# EAGLE design EN715_ExpansionBoard_ver1_2 (EAGLE 9.6.2)
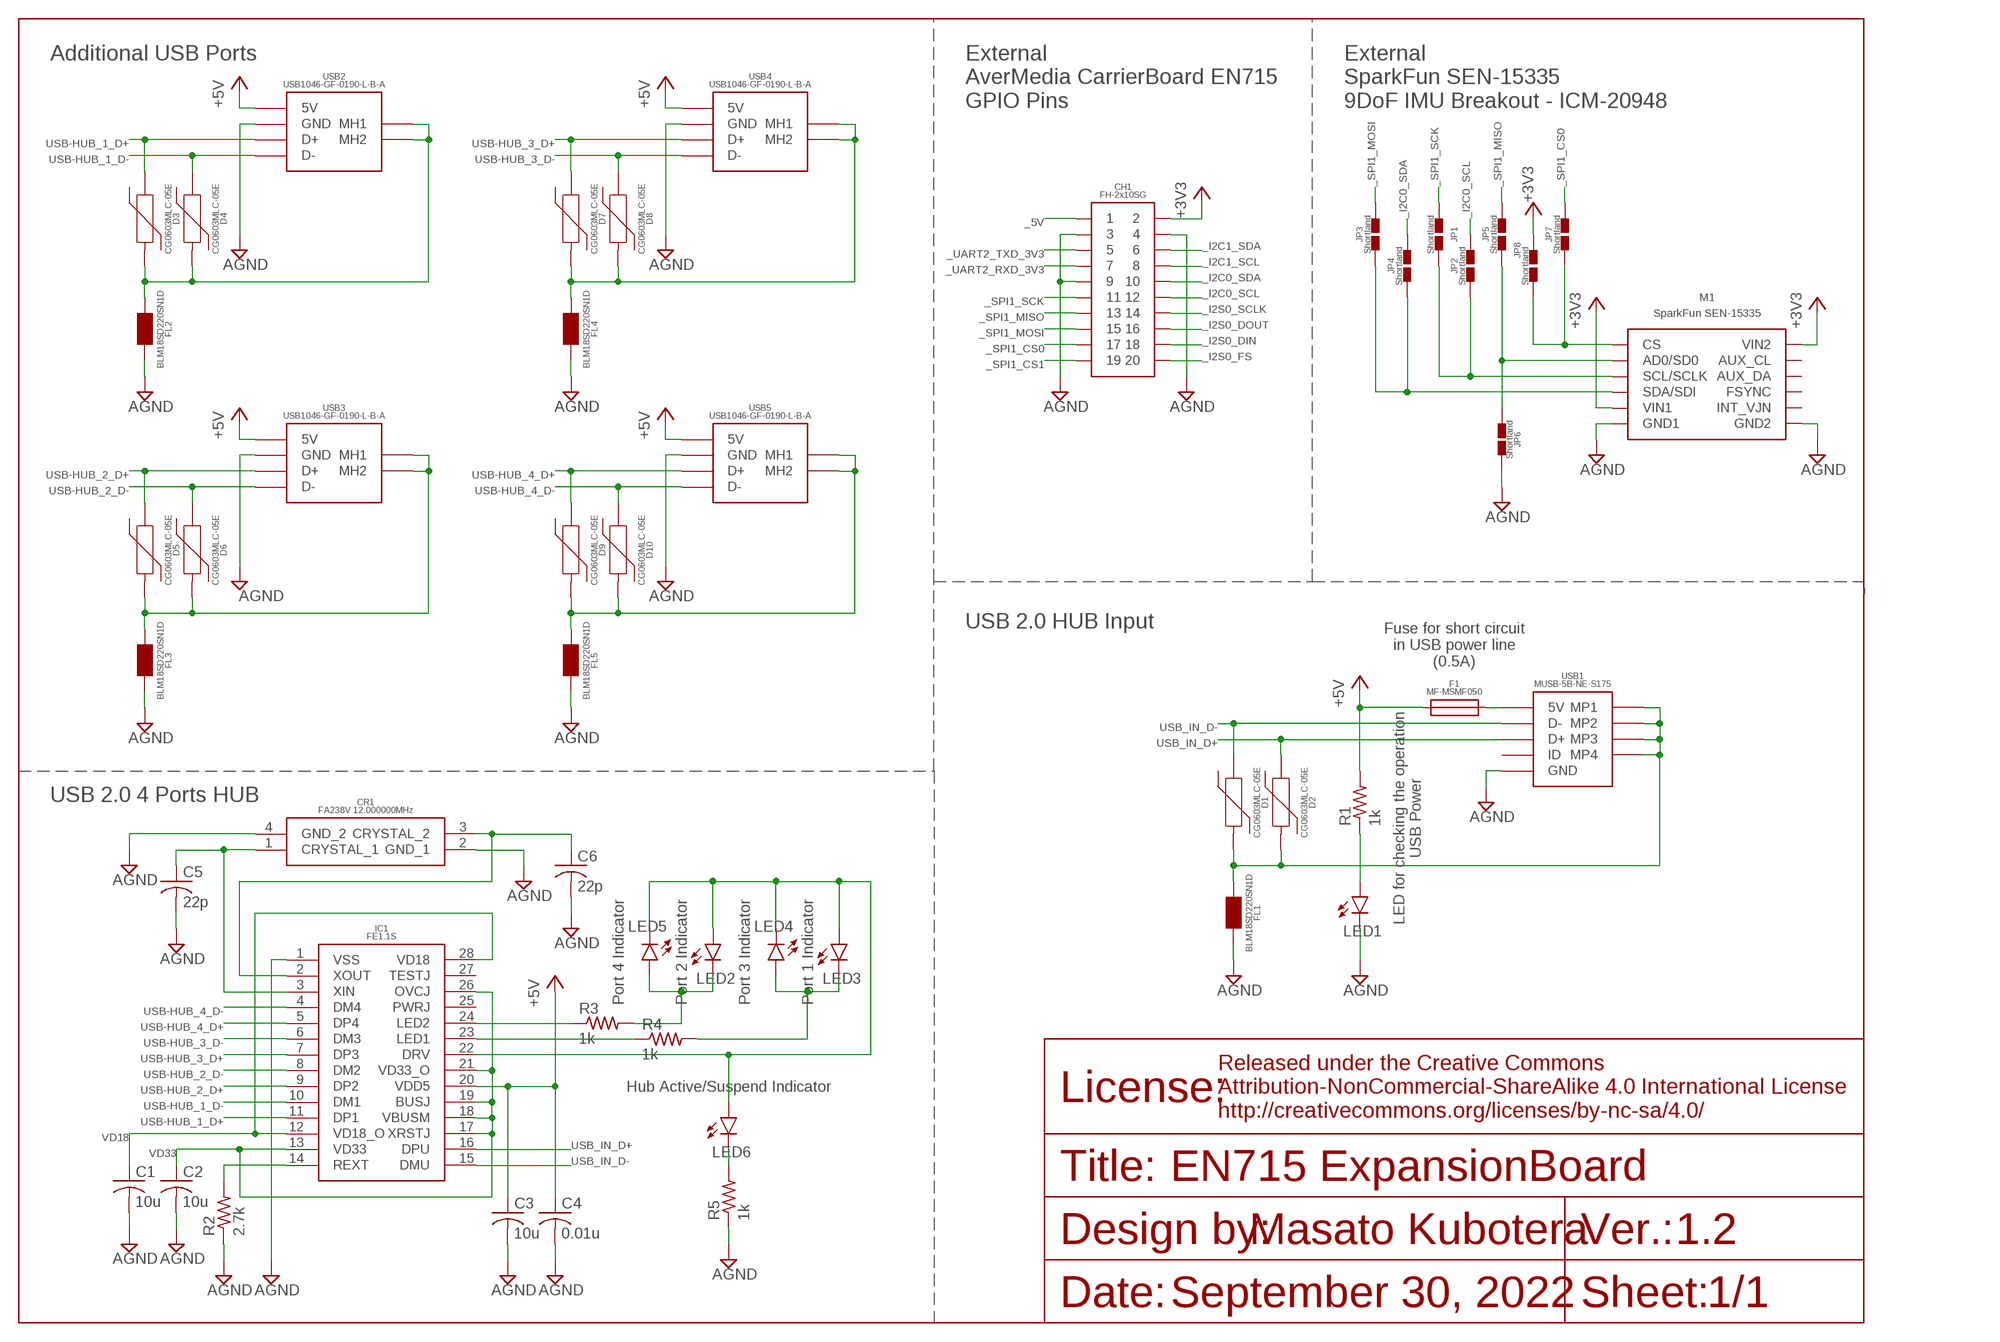
[diagram p0: schematic, sheet 1]

## Parts
C1  10u  C-USC0603  [C0603]
C2  10u  C-USC0603  [C0603]
C3  10u  C-USC0603  [C0603]
C4  0.01u  C-USC0603  [C0603]
C5  22p  C-USC0603  [C0603]
C6  22p  C-USC0603  [C0603]
CH1  2X10  [2X10]
CR1  FA238V_12.000000MHZ  [FA238V]
D1  CG0603MLC-05E  [CG0603MLC-05E]
D2  CG0603MLC-05E  [CG0603MLC-05E]
D3  CG0603MLC-05E  [CG0603MLC-05E]
D4  CG0603MLC-05E  [CG0603MLC-05E]
D5  CG0603MLC-05E  [CG0603MLC-05E]
D6  CG0603MLC-05E  [CG0603MLC-05E]
D7  CG0603MLC-05E  [CG0603MLC-05E]
D8  CG0603MLC-05E  [CG0603MLC-05E]
D9  CG0603MLC-05E  [CG0603MLC-05E]
D10  CG0603MLC-05E  [CG0603MLC-05E]
F1  MF-MSMF050  [MF-MSMF050]
FL1  BLM18SD220SN1D  [BLM18SD220SN1D]
FL2  BLM18SD220SN1D  [BLM18SD220SN1D]
FL3  BLM18SD220SN1D  [BLM18SD220SN1D]
FL4  BLM18SD220SN1D  [BLM18SD220SN1D]
FL5  BLM18SD220SN1D  [BLM18SD220SN1D]
IC1  FE1.1S  [FE1.1S]
JP1  SHORTLAND  [SHORTLAND]
JP2  SHORTLAND  [SHORTLAND]
JP3  SHORTLAND  [SHORTLAND]
JP4  SHORTLAND  [SHORTLAND]
JP5  SHORTLAND  [SHORTLAND]
JP6  SHORTLAND  [SHORTLAND]
JP7  SHORTLAND  [SHORTLAND]
JP8  SHORTLAND  [SHORTLAND]
LED1  LEDSML0603  [SML0603]
LED2  LEDSML0603  [SML0603]
LED3  LEDSML0603  [SML0603]
LED4  LEDSML0603  [SML0603]
LED5  LEDSML0603  [SML0603]
LED6  LEDSML0603  [SML0603]
M1  SPARKFUN_SEN-15335  [SPARKFUN_SEN-15335]
R1  1k  R-US_R0603  [R0603]
R2  2.7k  R-US_R0603  [R0603]
R3  1k  R-US_R0603  [R0603]
R4  1k  R-US_R0603  [R0603]
R5  1k  R-US_R0603  [R0603]
USB1  MINI_USB_B_SMD  [MINI_USB_B_SMD]
USB2  USB_A_X1_SMD  [USB_A_X1_SMD]
USB3  USB_A_X1_SMD  [USB_A_X1_SMD]
USB4  USB_A_X1_SMD  [USB_A_X1_SMD]
USB5  USB_A_X1_SMD  [USB_A_X1_SMD]

## Nets
+3V3 [USB-Power]: CH1.2 JP8.2 M1.VIN1(VIN2) M1.VIN(VIN1)
+5V [USB-Power]: C3.1 C4.1 F1.1 IC1.20(VDD5) R1.2 USB2.1(5V) USB3.1(5V) USB4.1(5V) USB5.1(5V)
_5V [USB-Power]: CH1.1
_I2C0_SCL [USB-Data]: CH1.12 JP2.2
_I2C0_SDA [USB-Data]: CH1.10 JP4.2
_I2C1_SCL [USB-Data]: CH1.8
_I2C1_SDA [USB-Data]: CH1.6
_I2S0_DIN [USB-Data]: CH1.18
_I2S0_DOUT [USB-Data]: CH1.16
_I2S0_FS [USB-Data]: CH1.20
_I2S0_SCLK [USB-Data]: CH1.14
_SPI1_CS0 [USB-Data]: CH1.17 JP7.2
_SPI1_CS1 [USB-Data]: CH1.19
_SPI1_MISO [USB-Data]: CH1.13 JP5.2
_SPI1_MOSI [USB-Data]: CH1.15 JP3.2
_SPI1_SCK [USB-Data]: CH1.11 JP1.2
_UART2_RXD_3V3 [USB-Data]: CH1.7
_UART2_TXD_3V3 [USB-Data]: CH1.5
AGND [USB-Power]: C1.2 C2.2 C3.2 C4.2 C5.2 C6.2 CH1.3 CH1.4 CH1.9 CR1.2(GND_1) CR1.4(GND_2) FL1.2 FL2.2 FL3.2 FL4.2 FL5.2 IC1.1(VSS) JP6.2 LED1.C M1.GND1 M1.GND2 R2.1 R5.1 USB1.5(GND) USB2.4(GND) USB3.4(GND) USB4.4(GND) USB5.4(GND)
B_FUSE_USB_MINI_B [USB-Power]: F1.2 USB1.1(5V)
FE1.1S_DRV [LED-Power]: IC1.22(DRV) LED2.A LED3.A LED4.C LED5.C LED6.A
FE1.1S_DRV_LED_A [LED-Power]: LED6.C R5.2
FE1.1S_LED_1_A [LED-Power]: LED3.C LED4.A R4.2
FE1.1S_LED_1_B [LED-Power]: IC1.23(LED1) R4.1
FE1.1S_LED_2_A [LED-Power]: LED2.C LED5.A R3.2
FE1.1S_LED_2_B [LED-Power]: IC1.24(LED2) R3.1
IMU_AD0/SD0 [USB-Data]: JP5.1 JP6.1 M1.AD0/SD0
IMU_SCL/SCLK [USB-Data]: JP1.1 JP2.1 M1.SCL/SCLK
IMU_SDA/SDI [USB-Data]: JP3.1 JP4.1 M1.SDA/SDI
LED_USBIN [LED-Power]: LED1.A R1.1
MPU9250_CS [USB-Data]: JP7.1 JP8.1 M1.CS
REXT_FE1.1S [USB-Data]: IC1.14(REXT) R2.2
USB-HUB_1_D+ [USB-Data]: D3.1 IC1.11(DP1) USB2.3(D+)
USB-HUB_1_D- [USB-Data]: D4.1 IC1.10(DM1) USB2.2(D-)
USB-HUB_2_D+ [USB-Data]: D5.1 IC1.9(DP2) USB3.3(D+)
USB-HUB_2_D- [USB-Data]: D6.1 IC1.8(DM2) USB3.2(D-)
USB-HUB_3_D+ [USB-Data]: D7.1 IC1.7(DP3) USB4.3(D+)
USB-HUB_3_D- [USB-Data]: D8.1 IC1.6(DM3) USB4.2(D-)
USB-HUB_4_D+ [USB-Data]: D9.1 IC1.5(DP4) USB5.3(D+)
USB-HUB_4_D- [USB-Data]: D10.1 IC1.4(DM4) USB5.2(D-)
USB_A_1_SHIELD [USB-Data]: D3.2 D4.2 FL2.1 USB2.MH1 USB2.MH2
USB_A_2_SHIELD [USB-Data]: D5.2 D6.2 FL3.1 USB3.MH1 USB3.MH2
USB_A_3_SHIELD [USB-Data]: D7.2 D8.2 FL4.1 USB4.MH1 USB4.MH2
USB_A_4_SHIELD [USB-Data]: D9.2 D10.2 FL5.1 USB5.MH1 USB5.MH2
USB_IN_D+ [USB-Data]: D2.1 IC1.16(DPU) USB1.3(D+)
USB_IN_D- [USB-Data]: D1.1 IC1.15(DMU) USB1.2(D-)
USB_MINI_B_SHIELD [USB-Data]: D1.2 D2.2 FL1.1 USB1.MP1 USB1.MP2 USB1.MP3 USB1.MP4
VD18 [USB-Power]: C1.1 IC1.12(VD18_O) IC1.28(VD18)
VD33 [USB-Power]: C2.1 IC1.13(VD33) IC1.17(XRSTJ) IC1.18(VBUSM) IC1.19(BUSJ) IC1.21(VD33_O) IC1.26(OVCJ)
XIN_FE1.1S [USB-Data]: C5.1 CR1.1(CRYSTAL_1) IC1.3(XIN)
XOUT_FE1.1S [USB-Data]: C6.1 CR1.3(CRYSTAL_2) IC1.2(XOUT)
Unconnected: IC1.25(PWRJ) IC1.27(TESTJ) M1.AUX_CL M1.AUX_DA M1.FSYNC M1.INT_VJN USB1.4(ID)

## Notes on the sheet
- Additional USB Ports
- External
  AverMedia CarrierBoard EN715
  GPIO Pins
- External
  SparkFun SEN-15335
  9DoF IMU Breakout - ICM-20948
- USB 2.0 HUB Input
- Fuse for short circuit
  in USB power line
  (0.5A)
- USB 2.0 4 Ports HUB
- LED for checking the operation
  USB Power
- Port 4 Indicator | Port 2 Indicator | Port 3 Indicator | Port 1 Indicator
- Hub Active/Suspend Indicator
- EN715 ExpansionBoard
- 1.2
- September 30, 2022 | 1/1

## Library data of the parts
C1-C6 = rcl:C-US: CAPACITOR, American symbol; SPICEPREFIX: C
CH1 = Pin_socket:2X10
CR1 = FA238V:FA238V_12.000000MHZ
D1-D10 = CG0603MLC-05E:CG0603MLC-05E
F1 = MF-MSMF:MF-MSMF050
FL1-FL5 = BLM18SD220SN1D:BLM18SD220SN1D
IC1 = FE1.1S:FE1.1S
JP1-JP8 = Shortland:SHORTLAND
LED1-LED6 = led:LED: LED OSRAM: - CHIPLED LG R971, LG N971, LY N971, LG Q971, LY Q971, LO R971, LY R971 LH N974, LH R974 LS Q976, LO Q976, LY Q976 LO Q996 - Hyper CHIPLED LW Q18S LB Q993, LB Q99A, LB R99A - SideLED LS A670, LO A670, LY A670, LG A670, LP A670 LB A673, LV A673, LT A673, LW A673 LH A674 LY A675 LS A676, LA A676, LO A676, LY A676, LW A676 LS A679, LY A679, LG A679 - Hyper Micro SIDELED® LS Y876, LA Y876, LO Y876, LY Y876 LT Y87S - SmartLED LW L88C, LW L88S LB L89C, LB L89S, LG L890 LS L89K, LO L89K, LY L89K LS L896, LA L896, LO L896, LY L896 - TOPLED LS T670, LO T670, LY T670, LG T670, LP T670 LSG T670, LSP T670, LSY T670, LOP T670, LYG T670 LG T671, LOG T671, LSG T671 LB T673, LV T673, LT T673, LW T673 LH T674 LS T676, LA T676, LO T676, LY T676, LB T676, LH T676, LSB T676, LW T676 LB T67C, LV T67C, LT T67C, LS T67K, LO T67K, LY T67K, LW E67C LS E67B, LA E67B, LO E67B, LY E67B, LB E67C, LV E67C, LT E67C LW T67C LS T679, LY T679, LG T679 LS T770, LO T770, LY T770, LG T770, LP T770 LB T773, LV T773, LT T773, LW T773 LH T774 LS E675, LA E675, LY E675, LS T675 LS T776, LA T776, LO T776, LY T776, LB T776 LHGB T686 LT T68C, LB T68C - Hyper Mini TOPLED® LB M676 - Mini TOPLED Santana® LG M470 LS M47K, LO M47K, LY M47K Source: http://www.osram.convergy.de LUXEON: - LUMILED® LXK2-PW12-R00, LXK2-PW12-S00, LXK2-PW14-U00, LXK2-PW14-V00 LXK2-PM12-R00, LXK2-PM12-S00, LXK2-PM14-U00 LXK2-PE12-Q00, LXK2-PE12-R00, LXK2-PE12-S00, LXK2-PE14-T00, LXK2-PE14-U00 LXK2-PB12-K00, LXK2-PB12-L00, LXK2-PB12-M00, LXK2-PB14-N00, LXK2-PB14-P00, LXK2-PB14-Q00 LXK2-PR12-L00, LXK2-PR12-M00, LXK2-PR14-Q00, LXK2-PR14-R00 LXK2-PD12-Q00, LXK2-PD12-R00, LXK2-PD12-S00 LXK2-PH12-R00, LXK2-PH12-S00 LXK2-PL12-P00, LXK2-PL12-Q00, LXK2-PL12-R00 Source: www.luxeon.com KINGBRIGHT: KA-3528ASYC Source: www.kingbright.com
M1 = SparkFun SEN-15335:SPARKFUN_SEN-15335
R1-R5 = rcl:R-US_: RESISTOR, American symbol; SPICEPREFIX: R
USB1 = USB_Connector:MINI_USB_B_SMD
USB2-USB5 = USB_Connector:USB_A_X1_SMD

## Net classes
1 USB-Data: width 0.254 mm, drill 0.127 mm, clearance 0.203 mm
2 USB-Power: width 0.381 mm, drill 0.127 mm, clearance 0.203 mm
3 LED-Power: width 0.254 mm, drill 0.127 mm, clearance 0.203 mm

## Board
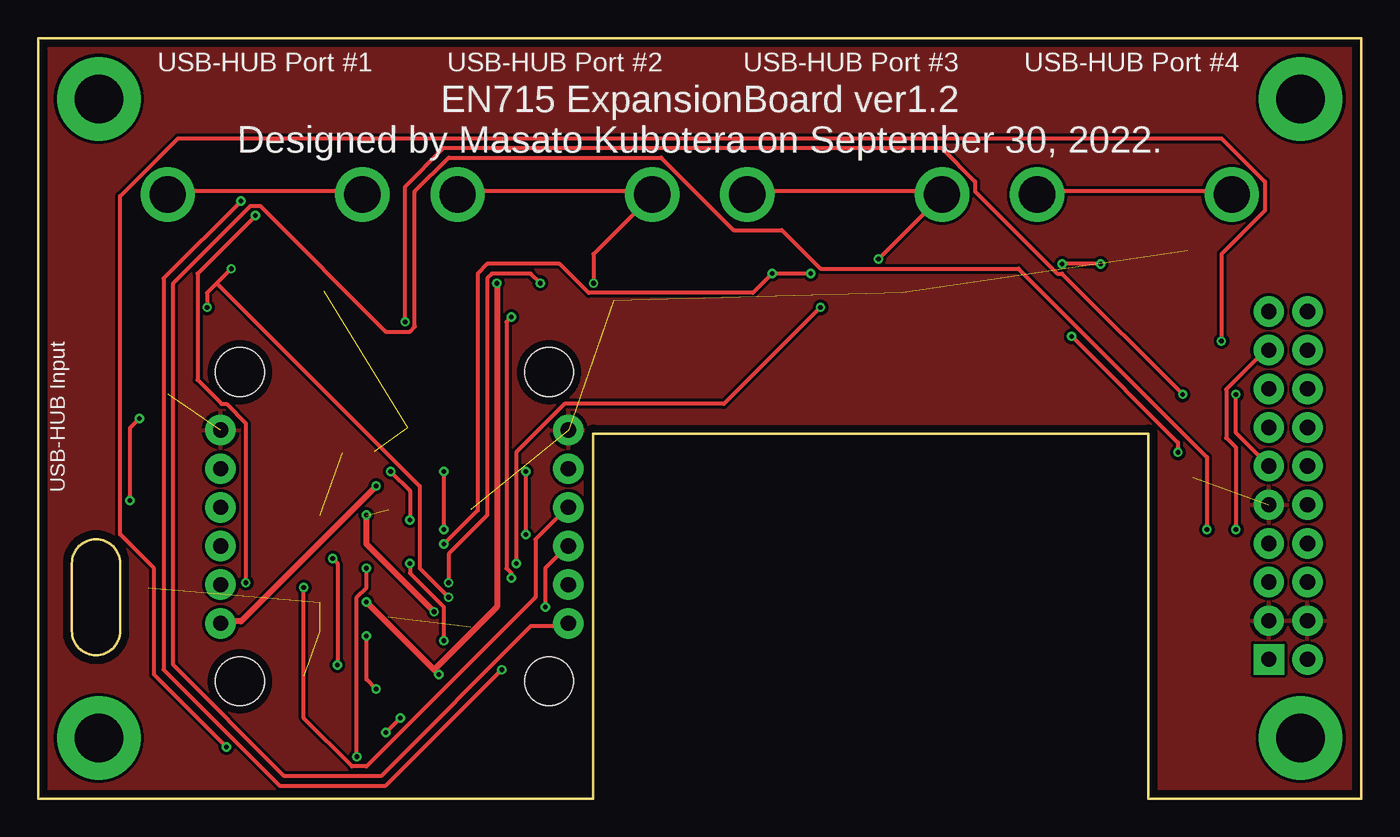
[diagram p1: board, top side]
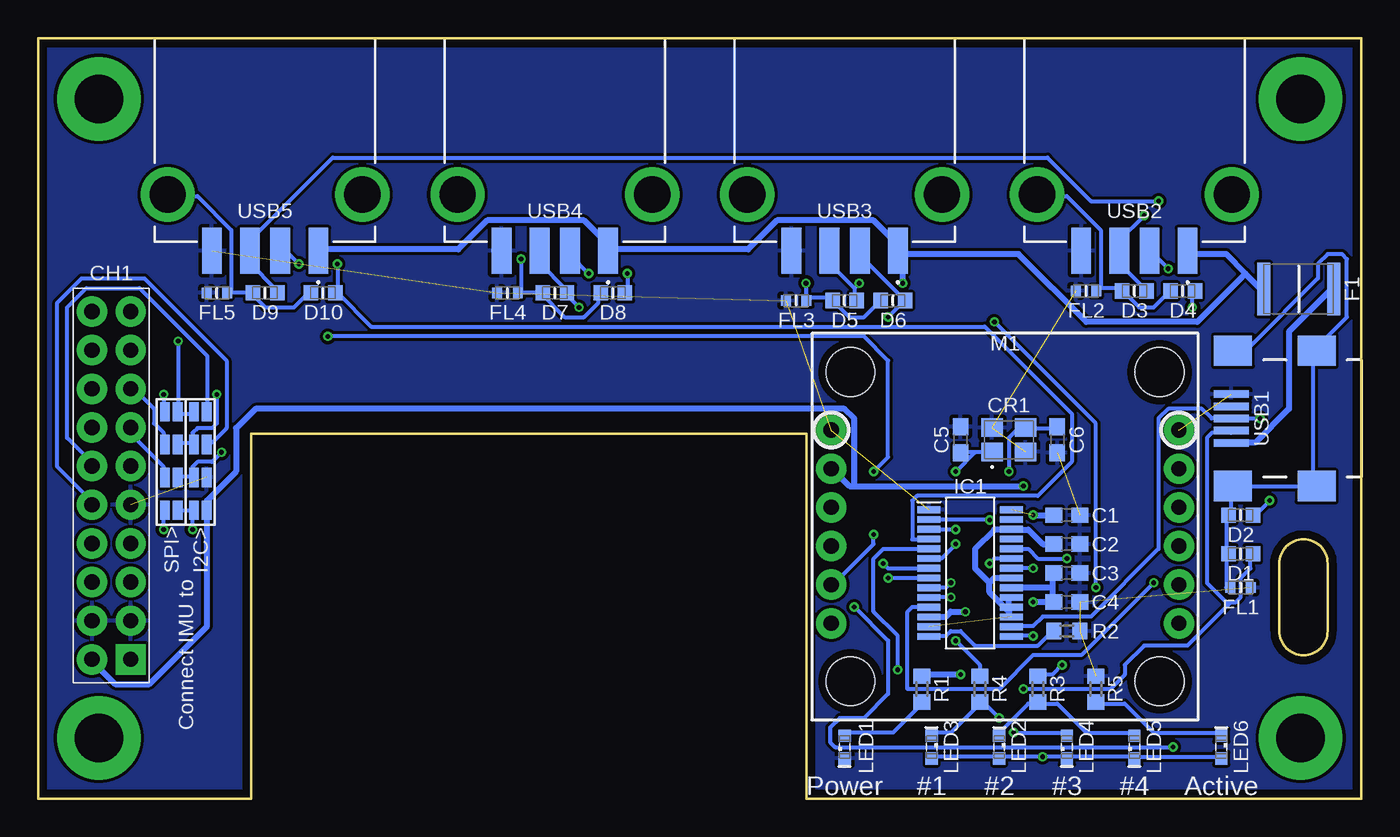
[diagram p2: board, bottom side, seen from below]

Size 87 x 50 mm. Coordinates in mm from the lower left corner, seen from the top.
Outline: 0,50 0,0 36.5,0 36.5,24 73,24 73,0 87,0 87,50 0,50
Outline: 5.4,11.03 arc-180 2.23,11.03 2.23,15.47 arc-180 5.4,15.47 5.4,11.03
Copper layers (1*16): Top 0.035mm / dielectric 1.6mm / Bottom 0.035mm
Design rules "Elecrow_2-layer_PCB_eagle_rule": minimum track width 6mil, minimum drill 12mil, track to track 6mil, track to pad 6mil, pad to pad 6mil, via to via 8mil, smd to smd 0mil, copper to edge 20mil, drill to drill 10mil, minimum pad ring 6mil, minimum via ring 6mil, stop-mask expansion 0mil, vias tented up to drill 100mil, thermal gap 10mil

### Footprints (pad centres in the part's own frame; a part is rotated, then mirrored left to right if it is on the bottom)
C0603 = smd 1.1 x 1: 1 -0.85,0; 2 0.85,0
2X10 = drill 1 pad 2 square: 1 -11.43,-1.27 | drill 1 pad 2: 2 -11.43,1.27; 3 -8.89,-1.27; 4 -8.89,1.27; 5 -6.35,-1.27; 6 -6.35,1.27; 7 -3.81,-1.27; 8 -3.81,1.27; 9 -1.27,-1.27; 10 -1.27,1.27; 11 1.27,-1.27; 12 1.27,1.27; 13 3.81,-1.27; 14 3.81,1.27; 15 6.35,-1.27; 16 6.35,1.27; 17 8.89,-1.27; 18 8.89,1.27; 19 11.43,-1.27; 20 11.43,1.27
FA238V = smd 1.4 x 1.2: 1 -1.1,-0.8; 2 1.1,-0.8; 3 1.1,0.8; 4 -1.1,0.8
CG0603MLC-05E = smd 0.95 x 1: 1 -0.8,0; 2 0.8,0
MF-MSMF050 = smd 0.85 x 3.43: 1 -2.3,0; 2 2.3,0
BLM18SD220SN1D = smd 0.65 x 0.7: 1 -0.675,0; 2 0.675,0
FE1.1S = smd 1.525 x 0.44: 1 -2.712,4.16; 2 -2.712,3.52; 3 -2.712,2.88; 4 -2.712,2.24; 5 -2.712,1.6; 6 -2.712,0.96; 7 -2.712,0.32; 8 -2.712,-0.32; 9 -2.712,-0.96; 10 -2.712,-1.6; 11 -2.712,-2.24; 12 -2.712,-2.88; 13 -2.712,-3.52; 14 -2.712,-4.16; 15 2.712,-4.16; 16 2.712,-3.52; 17 2.712,-2.88; 18 2.712,-2.24; 19 2.712,-1.6; 20 2.712,-0.96; 21 2.712,-0.32; 22 2.712,0.32; 23 2.712,0.96; 24 2.712,1.6; 25 2.712,2.24; 26 2.712,2.88; 27 2.712,3.52; 28 2.712,4.16
SHORTLAND = smd 0.635 x 1.27: 1 -0.419,0; 2 0.419,0
SML0603 = smd 0.8 x 0.8: A 0.75,0; C -0.75,0
SPARKFUN_SEN-15335 = drill 1 pad 2: AD0/SD0 -11.43,-3.81; AUX_CL 11.43,-3.81; AUX_DA 11.43,-1.27; CS -11.43,-6.35; FSYNC 11.43,1.27; GND1 -11.43,6.35; GND2 11.43,6.35; INT_VJN 11.43,3.81; SCL/SCLK -11.43,-1.27; SDA/SDI -11.43,1.27; VIN 11.43,-6.35; VIN1 -11.43,3.81 | hole 3.2: -10.16,10.16; 10.16,10.16; -10.16,-10.16; 10.16,-10.16
R0603 = smd 1 x 1.1: 1 -0.85,0; 2 0.85,0
MINI_USB_B_SMD = smd 0.5 x 2.3: 1 -1.6,8.55; 2 -0.8,8.55; 3 0,8.55; 4 0.8,8.55; 5 1.6,8.55 | smd 2 x 2.5: MP1 -4.45,8.45; MP2 4.45,8.45; MP3 4.45,2.95; MP4 -4.45,2.95
USB_A_X1_SMD = smd 1.3 x 3: 1 -3.5,13.98; 2 -1,13.98; 3 1,13.98; 4 3.5,13.98 | drill 2.38 pad 3.57: MH1 -6.4,10.28; MH2 6.4,10.28

### Placement (x,y rotation side)
C1  19.37,18.65 0 bottom
C2  19.37,16.74 0 bottom
C3  19.37,14.84 0 bottom
C4  19.37,12.94 0 bottom
C5  26.36,23.6 90 bottom
C6  20,23.6 270 bottom
CH1  82.18,20.6 90 bottom
CR1  23.18,23.6 0 bottom
D1  7.94,16.11 180 bottom
D2  7.94,18.65 180 bottom
D3  14.93,33.38 180 bottom
D4  11.75,33.38 180 bottom
D5  33.98,32.75 180 bottom
D6  30.8,32.75 180 bottom
D7  53.02,33.26 180 bottom
D8  49.22,33.26 180 bottom
D9  72.08,33.26 180 bottom
D10  68.27,33.26 180 bottom
F1  4.13,33.51 0 bottom
FL1  7.94,13.89 0 bottom
FL2  18.1,33.38 180 bottom
FL3  37.15,32.75 180 bottom
FL4  56.14,33.26 180 bottom
FL5  75.25,33.26 180 bottom
IC1  25.72,14.84 0 bottom
JP1  78.23,25.44 180 bottom
JP2  76.33,25.44 0 bottom
JP3  78.23,23.29 180 bottom
JP4  76.33,23.29 0 bottom
JP5  78.23,21.13 180 bottom
JP6  76.33,21.13 0 bottom
JP7  78.23,18.97 180 bottom
JP8  76.33,18.97 0 bottom
LED1  33.98,3.41 90 bottom
LED2  23.82,3.41 270 bottom
LED3  28.26,3.41 270 bottom
LED4  19.37,3.41 90 bottom
LED5  14.93,3.41 90 bottom
LED6  9.21,3.41 270 bottom
M1  23.43,17.89 0 bottom
R1  28.89,7.22 90 bottom
R2  19.37,11.03 180 bottom
R3  21.27,7.22 270 bottom
R4  25.09,7.22 270 bottom
R5  17.46,7.22 270 bottom
USB1  0,25 90 bottom
USB2  14.93,50 180 bottom
USB3  33.98,50 180 bottom
USB4  53.02,50 180 bottom
USB5  72.08,50 180 bottom

### Tracks (layer width: path | path; a pad name or v marks a point on that pad's centre or on a via)
+3V3  (via drill 0.3)
  Top 0.381: v22.23,20.55 13.34,11.66 12.07,11.66 M1.VIN
  Bottom 0.381: 75.88,18.97 75.88,11.35 79.69,7.54 81.92,7.54 83.5,9.12 CH1.2 | 33.34,20.55 33.66,20.55 34.61,21.51 M1.VIN1 | 33.34,20.55 v22.23,20.55 | 75.88,18.97 75.88,19.6 73.98,21.51 73.98,24.36 72.71,25.64 33.98,25.64 33.34,25 33.34,20.55 | 75.88,18.97 JP8.2
+5V  (via drill 0.3)
  Top 0.381: v21.59,12.94 26.04,8.49 | 26.04,8.49 v26.36,8.17 | 26.04,8.49 30.16,12.62 v30.16,33.89
  Bottom 0.381: 20.32,13.89 20.32,14.84 C3.1 | 20.32,13.89 20.32,12.94 | v26.36,8.17 28.89,8.17 R1.2 | 20.32,12.94 v21.59,12.94 | 20.32,12.94 C4.1 | 20.32,13.89 22.86,13.89 IC1.20 | 7.62,34.52 6.67,33.57 F1.1 | 7.62,34.52 8.89,35.8 11.12,35.8 USB2.1 | 30.16,35.8 22.55,35.8 18.1,31.35 10.8,31.35 7.62,34.52 | 49.22,36.11 40.33,36.11 38.42,38.02 32.07,38.02 30.16,36.11 USB3.1 30.16,35.8 | 49.22,36.11 51.12,38.02 57.47,38.02 59.38,36.11 68.27,36.11 USB5.1 | 49.22,36.11 USB4.1 | 30.16,35.8 v30.16,33.89
_I2C0_SCL
  Bottom 0.254: JP2.2 75.88,25.64 75.88,29.13 80.33,33.57 83.82,33.57 85.09,32.3 85.09,23.73 83.5,22.14 CH1.12
_I2C0_SDA
  Bottom 0.254: JP4.2 75.88,23.41 75.57,23.41 74.61,24.36 74.61,28.81 80.01,34.21 84.14,34.21 85.73,32.62 85.73,21.82 83.5,19.6 CH1.10
_SPI1_CS0  (via drill 0.3)
  Top 0.254: v78.74,17.7 78.74,23.09 78.11,23.73 78.11,26.91 80.65,29.45 CH1.17
  Bottom 0.254: v78.74,17.7 78.74,18.97 JP7.2
_SPI1_MISO
  Bottom 0.254: JP5.2 78.74,21.19 78.74,21.82 80.65,23.73 80.65,24.36 CH1.13
_SPI1_MOSI
  Bottom 0.254: JP3.2 78.74,23.41 78.74,24.05 79.38,24.68 79.38,25.64 80.65,26.91 CH1.15
_SPI1_SCK  (via drill 0.3)
  Top 0.254: v78.74,26.59 78.74,24.05 80.65,22.14 CH1.11
  Bottom 0.254: v78.74,26.59 78.74,25.64 JP1.2
AGND  (12 unrouted)
  pour Top: -0.95,51.03 -0.95,-1.04 37.42,-1.04 37.42,23.09 72.44,23.09 72.44,-1.04 87.95,-1.04 87.95,51.03
  pour Bottom: -1.59,51.67 -1.59,-1.67 38.05,-1.67 38.05,22.46 71.81,22.46 71.81,-1.67 88.59,-1.67 88.59,51.67
B_FUSE_USB_MINI_B
  Bottom 0.381: USB1.1 8.26,23.41 6.99,23.41 4.77,25.64 4.77,30.71 1.91,33.57 F1.2
FE1.1S_DRV  (via drill 0.3)
  Top 0.254: v21.59,15.16 21.59,13.89 20.96,13.25 v20.96,2.77
  Bottom 0.254: 14.93,2.77 9.21,2.77 LED6.A | 14.93,2.77 19.37,2.77 | 14.93,2.77 LED5.C | 19.37,2.77 v20.96,2.77 23.82,2.77 | 19.37,2.77 LED4.C | 23.82,2.77 28.26,2.77 LED3.A | 23.82,2.77 LED2.A | v21.59,15.16 22.86,15.16 IC1.22
FE1.1S_DRV_LED_A
  Bottom 0.254: LED6.C 9.21,4.36 13.66,4.36 15.56,6.27 17.46,6.27 R5.2
FE1.1S_LED_1_A  (via drill 0.3)
  Top 0.254: v23.82,5.32 v22.86,4.36
  Bottom 0.254: v22.86,4.36 19.37,4.36 LED4.A | v23.82,5.32 25.09,6.59 R4.2 25.09,6.27 26.99,4.36 28.26,4.36 LED3.C
FE1.1S_LED_1_B  (via drill 0.3)
  Top 0.254: v26.67,10.39 26.67,12.62 24.45,14.84 v24.45,15.47
  Bottom 0.254: R4.1 25.09,8.81 v26.67,10.39 | v24.45,15.47 24.13,15.79 23.18,15.79 IC1.23
FE1.1S_LED_2_A
  Bottom 0.254: 21.27,6.27 20,6.27 18.1,4.36 14.93,4.36 LED5.A | 21.27,6.27 21.91,6.27 23.82,4.36 LED2.C | 21.27,6.27 R3.2
FE1.1S_LED_2_B  (via drill 0.3)
  Top 0.254: v19.69,8.81 19.69,15.47 v19.37,15.79
  Bottom 0.254: v19.69,8.81 20.32,8.17 21.27,8.17 R3.1 | v19.37,15.79 21.27,15.79 21.91,16.43 22.86,16.43 IC1.24
IMU_AD0/SD0  (via drill 0.3)
  Top 0.254: v74.93,22.78 74.93,23.41 v67.95,30.4 | v32.07,17.38 v32.07,21.51
  Bottom 0.254: 76.84,21.19 77.79,21.19 JP5.1 | 76.84,21.19 76.84,21.82 76.52,22.14 75.57,22.14 v74.93,22.78 | v67.95,30.4 32.7,30.4 31.12,28.81 31.12,22.46 v32.07,21.51 | v32.07,17.38 32.07,16.74 34.61,14.21 M1.AD0/SD0 | 76.84,21.19 JP6.1
IMU_SCL/SCLK  (via drill 0.3)
  Top 0.254: v77.79,30.08 77.79,35.8 80.65,38.65 80.65,40.56 77.79,43.41 9.21,43.41 5.4,39.61 5.4,17.38 7.62,15.16 7.62,8.17 v12.39,3.41 | v33.34,12.62 33.34,15.16 34.61,16.43 M1.SCL/SCLK
  Bottom 0.254: JP2.1 76.84,25.32 77.79,25.32 JP1.1 77.79,25.64 v77.79,30.08 | v12.39,3.41 34.61,3.41 34.93,3.73 34.93,4.68 34.29,5.32 32.7,5.32 31.12,6.9 31.12,10.39 v33.34,12.62
IMU_SDA/SDI  (via drill 0.3)
  Top 0.254: v75.25,26.59 67.31,34.52 67,34.52 61.6,39.92 61.6,40.56 59.38,42.78 26.67,42.78 24.13,40.24 v24.13,31.35 | v17.46,13.89 17.46,5.32 20.64,2.14 21.59,2.14 32.7,13.25 32.7,17.06 34.61,18.97 M1.SDA/SDI
  Bottom 0.254: 76.84,23.41 77.79,23.41 JP3.1 | 76.84,23.41 76.84,24.05 76.52,24.36 75.57,24.36 75.25,24.68 v75.25,26.59 | v24.13,31.35 17.46,24.68 v17.46,13.89 | 76.84,23.41 JP4.1
LED_USBIN
  Bottom 0.254: LED1.A 33.98,4.36 30.8,4.36 28.89,6.27 R1.1
MPU9250_CS  (via drill 0.3)
  Top 0.254: v76.84,17.7 76.84,22.46 64.45,34.84 51.44,34.84 48.9,37.38 45.72,37.38 40.96,42.14 26.99,42.14 24.77,39.92 24.77,31.03 24.45,30.71 22.86,30.71 14.61,38.97 13.97,38.97 8.89,33.89 8.89,8.81 16.2,1.5 22.55,1.5 32.39,11.35 34.61,11.35 M1.CS
  Bottom 0.254: JP7.1 76.84,18.97 | v76.84,17.7 76.84,18.97 | 76.84,18.97 JP8.1
REXT_FE1.1S
  Bottom 0.254: R2.2 20.32,11.03 21.27,10.08 25.4,10.08 26.36,11.03 26.99,11.03 27.31,10.71 28.26,10.71 IC1.14
S$1  (via drill 3.2 pad 5.5)
  other vias: 4,46
S$2  (via drill 3.2 pad 5.5)
  other vias: 83,46
S$3  (via drill 3.2 pad 5.5)
  other vias: 83,4
S$4  (via drill 3.2 pad 5.5)
  other vias: 4,4
USB-HUB_1_D+  (via drill 0.3)
  Top 0.254: v13.66,14.21 13.66,24.68 12.39,25.95 12.07,25.95 10.48,27.54 10.48,34.52 v14.29,38.34
  Bottom 0.254: D3.1 14.29,33.57 15.88,35.16 15.88,35.8 USB2.3 15.88,36.11 15.88,36.75 v14.29,38.34 | v13.66,14.21 18.42,9.44 21.59,9.44 23.82,7.22 29.85,7.22 29.85,12.3 29.53,12.62 28.58,12.62 IC1.11
USB-HUB_1_D-  (via drill 0.3)
  Top 0.254: v11.12,32.3 11.12,33.26 11.75,33.89 | v12.7,34.84 11.75,33.89 | v26.99,13.25 25.09,15.16 25.09,20.55 11.75,33.89
  Bottom 0.254: v11.12,32.3 11.12,33.26 D4.1 | v12.7,34.84 13.66,35.8 USB2.2 | v26.99,13.25 28.26,13.25 IC1.10
USB-HUB_2_D+  (via drill 0.3)
  Top 0.254: v26.99,14.21 26.99,16.11 29.53,18.65 29.53,34.21 29.85,34.52 32.39,34.52 v33.02,33.89
  Bottom 0.254: 33.34,33.57 33.34,32.94 D5.1 | 33.34,33.57 34.93,35.16 34.93,35.8 USB3.3 | v26.99,14.21 27.31,13.89 28.26,13.89 IC1.9 | 33.34,33.57 v33.02,33.89
USB-HUB_2_D-  (via drill 0.3)
  Top 0.254: v31.12,14.52 31.12,14.84 30.8,15.16 30.8,31.35 v31.12,31.67
  Bottom 0.254: USB3.2 33.02,35.8 30.16,32.94 D6.1 30.16,32.62 v31.12,31.67 | v31.12,14.52 28.58,14.52 IC1.8
USB-HUB_3_D+  (via drill 0.3)
  Top 0.254: v31.44,15.47 31.44,22.78 34.61,25.95 45.09,25.95 v51.44,32.3
  Bottom 0.254: 52.39,33.26 52.39,33.57 53.98,35.16 53.98,35.8 USB4.3 | v31.44,15.47 31.12,15.16 28.58,15.16 IC1.7 | 52.39,33.26 v51.44,32.3 | 52.39,33.26 D7.1
USB-HUB_3_D-  (via drill 0.3)
  Top 0.254: v50.8,34.52 v48.26,34.52 46.99,33.26 36.2,33.26 34.29,35.16 29.53,35.16 28.89,34.52 28.89,18.97 v26.67,16.74
  Bottom 0.254: v48.26,34.52 48.26,33.26 D8.1 | v50.8,34.52 52.07,35.8 USB4.2 | v26.67,16.74 27.62,15.79 28.26,15.79 IC1.6
USB-HUB_4_D+  (via drill 0.3)
  Top 0.254: v30.48,8.49 22.86,0.87 15.88,0.87 8.26,8.49 8.26,34.21 v13.34,39.29
  Bottom 0.254: D9.1 71.44,33.26 71.44,33.57 73.03,35.16 73.03,35.8 USB5.3 73.03,36.11 73.03,36.75 67.63,42.14 20.64,42.14 17.78,39.29 v13.34,39.29 | v30.48,8.49 30.48,10.71 32.07,12.3 32.07,15.79 31.44,16.43 28.58,16.43 IC1.5
USB-HUB_4_D-  (via drill 0.3)
  Top 0.254: v69.85,35.16 v67.31,35.16
  Bottom 0.254: v67.31,35.16 67.31,33.26 | v69.85,35.16 70.81,36.11 USB5.2 | 67.31,33.26 65.09,31.03 24.77,31.03 19.05,25.32 19.05,22.14 21.27,19.92 29.21,19.92 29.53,19.6 29.53,17.06 28.58,17.06 IC1.4 | 67.31,33.26 D10.1
USB_A_1_SHIELD
  Top 0.254: USB2.MH1 8.58,39.92 21.27,39.92 USB2.MH2
  Bottom 0.254: 17.15,33.57 15.88,33.57 D3.2 15.56,33.26 14.61,32.3 13.66,32.3 12.7,33.26 D4.2 | 17.15,33.57 17.15,37.38 19.37,39.61 21.27,39.61 USB2.MH2 | 17.15,33.57 FL2.1
USB_A_2_SHIELD  (via drill 0.3)
  Top 0.254: v36.52,33.89 36.52,35.8 40.33,39.61 USB3.MH2 40.33,39.92 27.62,39.92 USB3.MH1
  Bottom 0.254: D6.2 31.75,32.62 32.7,31.67 33.66,31.67 34.61,32.62 D5.2 34.93,32.94 36.2,32.94 FL3.1 36.52,32.94 v36.52,33.89
USB_A_3_SHIELD  (via drill 0.3)
  Top 0.254: v55.25,35.48 59.38,39.61 USB4.MH2 59.38,39.92 46.67,39.92 USB4.MH1
  Bottom 0.254: 53.98,33.26 55.25,33.26 | 53.98,33.26 52.39,31.67 51.12,31.67 50.17,32.62 50.17,33.26 D8.2 | 53.98,33.26 D7.2 | v55.25,35.48 55.25,33.26 | 55.25,33.26 FL4.1
USB_A_4_SHIELD
  Top 0.254: USB5.MH1 65.72,39.92 78.42,39.92 USB5.MH2
  Bottom 0.254: 73.03,33.26 74.3,33.26 | 73.03,33.26 72.08,32.3 70.17,32.3 69.22,33.26 D10.2 | 73.03,33.26 D9.2 | 74.3,33.26 74.3,37.38 76.52,39.61 78.42,39.61 USB5.MH2 | 74.3,33.26 FL5.1
USB_IN_D+  (via drill 0.3)
  Top 0.254: v6.03,19.6 6.03,24.36 v6.67,25
  Bottom 0.254: v6.03,19.6 6.99,18.65 D2.1 | v6.67,25 USB1.3 9.84,25 10.48,25.64 12.7,25.64 13.34,25 13.34,16.43 17.78,11.98 20.96,11.98 21.59,11.35 22.86,11.35 IC1.16
USB_IN_D-  (via drill 0.3)
  Top 0.254: v21.59,10.71 21.59,7.86 v22.23,7.22
  Bottom 0.254: 8.58,12.94 8.89,12.94 10.16,14.21 10.16,23.73 9.84,24.05 8.58,24.05 USB1.2 | 8.58,12.94 8.26,12.94 7.94,13.25 7.94,14.52 7.3,15.16 7.3,16.11 D1.1 | v21.59,10.71 22.86,10.71 IC1.15 | v22.23,7.22 16.51,7.22 15.56,8.17 15.56,8.81 14.29,10.08 11.43,10.08 8.58,12.94
USB_MINI_B_SHIELD
  Bottom 0.254: 8.89,16.11 8.89,13.89 FL1.1 | 8.89,16.11 8.89,18.65 D2.2 8.58,18.65 8.58,20.24 USB1.MP1 8.26,20.55 3.18,20.55 | 8.89,16.11 D1.2 | 3.18,20.55 3.18,29.45 USB1.MP3 2.86,29.76 0.95,31.67 0.95,35.48 1.27,35.8 2.23,35.8 2.86,35.16 2.86,34.21 7.3,29.76 8.26,29.76 USB1.MP2 | 3.18,20.55 USB1.MP4
VD18  (via drill 0.3)  (1 unrouted)
  Top 0.381: v21.59,18.65 21.59,16.74 v26.04,12.3
  Bottom 0.381: v21.59,18.65 C1.1 | v26.04,12.3 26.99,12.3 27.31,11.98 28.26,11.98 IC1.12
VD33  (1 unrouted)
  Bottom 0.381: 23.18,12.62 23.18,12.3 | 23.18,12.3 23.18,11.98 IC1.17 | 23.18,12.62 23.18,13.25 IC1.19 | 23.18,12.62 IC1.18 | 24.45,14.21 24.13,14.52 23.18,14.52 IC1.21 | 24.45,14.21 24.45,13.57 23.18,12.3 | C2.1 20.96,16.74 21.91,17.7 22.86,17.7 IC1.26 23.18,17.7 24.13,17.7 25.4,16.43 25.4,15.16 24.45,14.21
XIN_FE1.1S  (via drill 0.3)
  Top 0.254: v26.67,21.51 v26.67,17.7
  Bottom 0.254: 25.4,22.78 24.45,22.78 CR1.1 | 25.4,22.78 26.36,22.78 C5.1 | v26.67,17.7 28.26,17.7 IC1.3 | 25.4,22.78 v26.67,21.51
XOUT_FE1.1S  (via drill 0.3)
  Top 0.254: v24.45,18.33 24.45,20.24 v23.18,21.51
  Bottom 0.254: C6.1 20,24.36 21.91,24.36 CR1.3 22.23,24.68 23.18,23.73 v23.18,21.51 | v24.45,18.33 28.26,18.33 IC1.2

### Text on the board
tPlace: USB-HUB Port #1 | USB-HUB Port #2 | USB-HUB Port #3 | USB-HUB Port #4 | EN715 ExpansionBoard ver1.2 / Designed by Masato Kubotera on September 30, 2022. | USB-HUB Input
bPlace: I2C> | Connect IMU to | SPI> | Active | #4 | #3 | #2 | #1 | Power